# EAGLE board 3dofboard (EAGLE 6.5.0), part 1 of 2
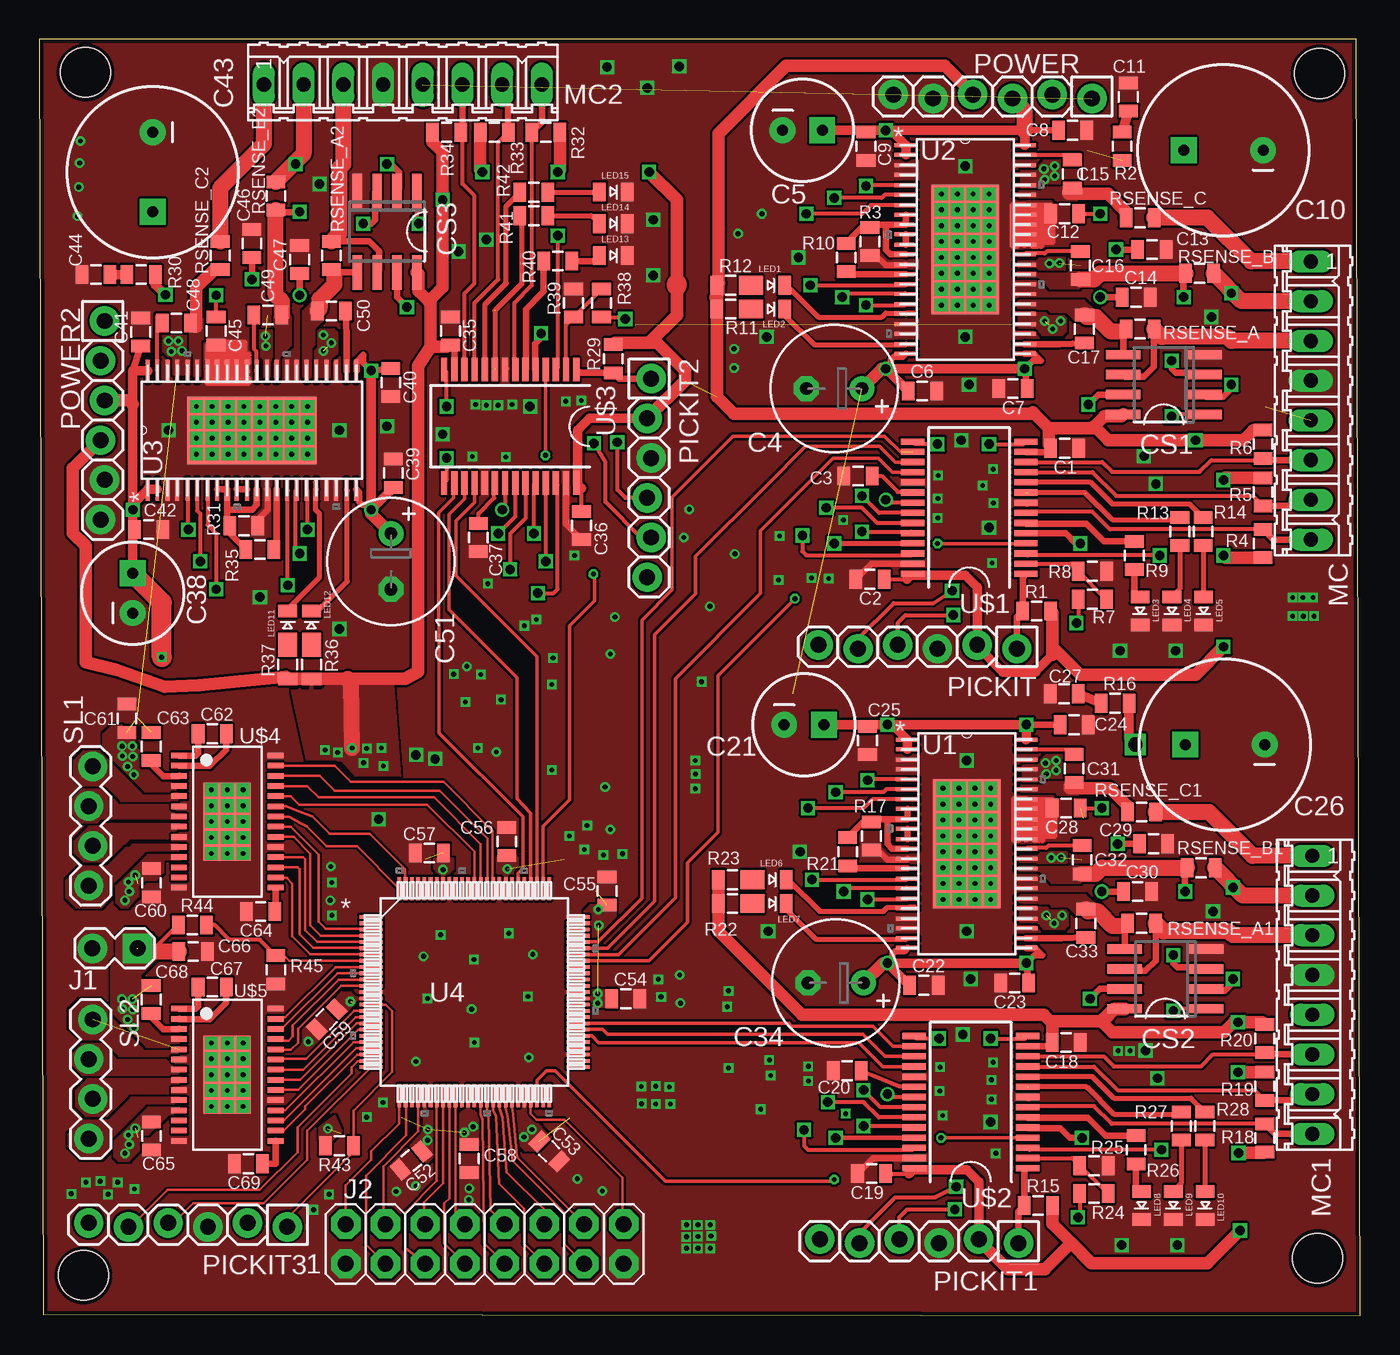
[diagram p3: board, top side]
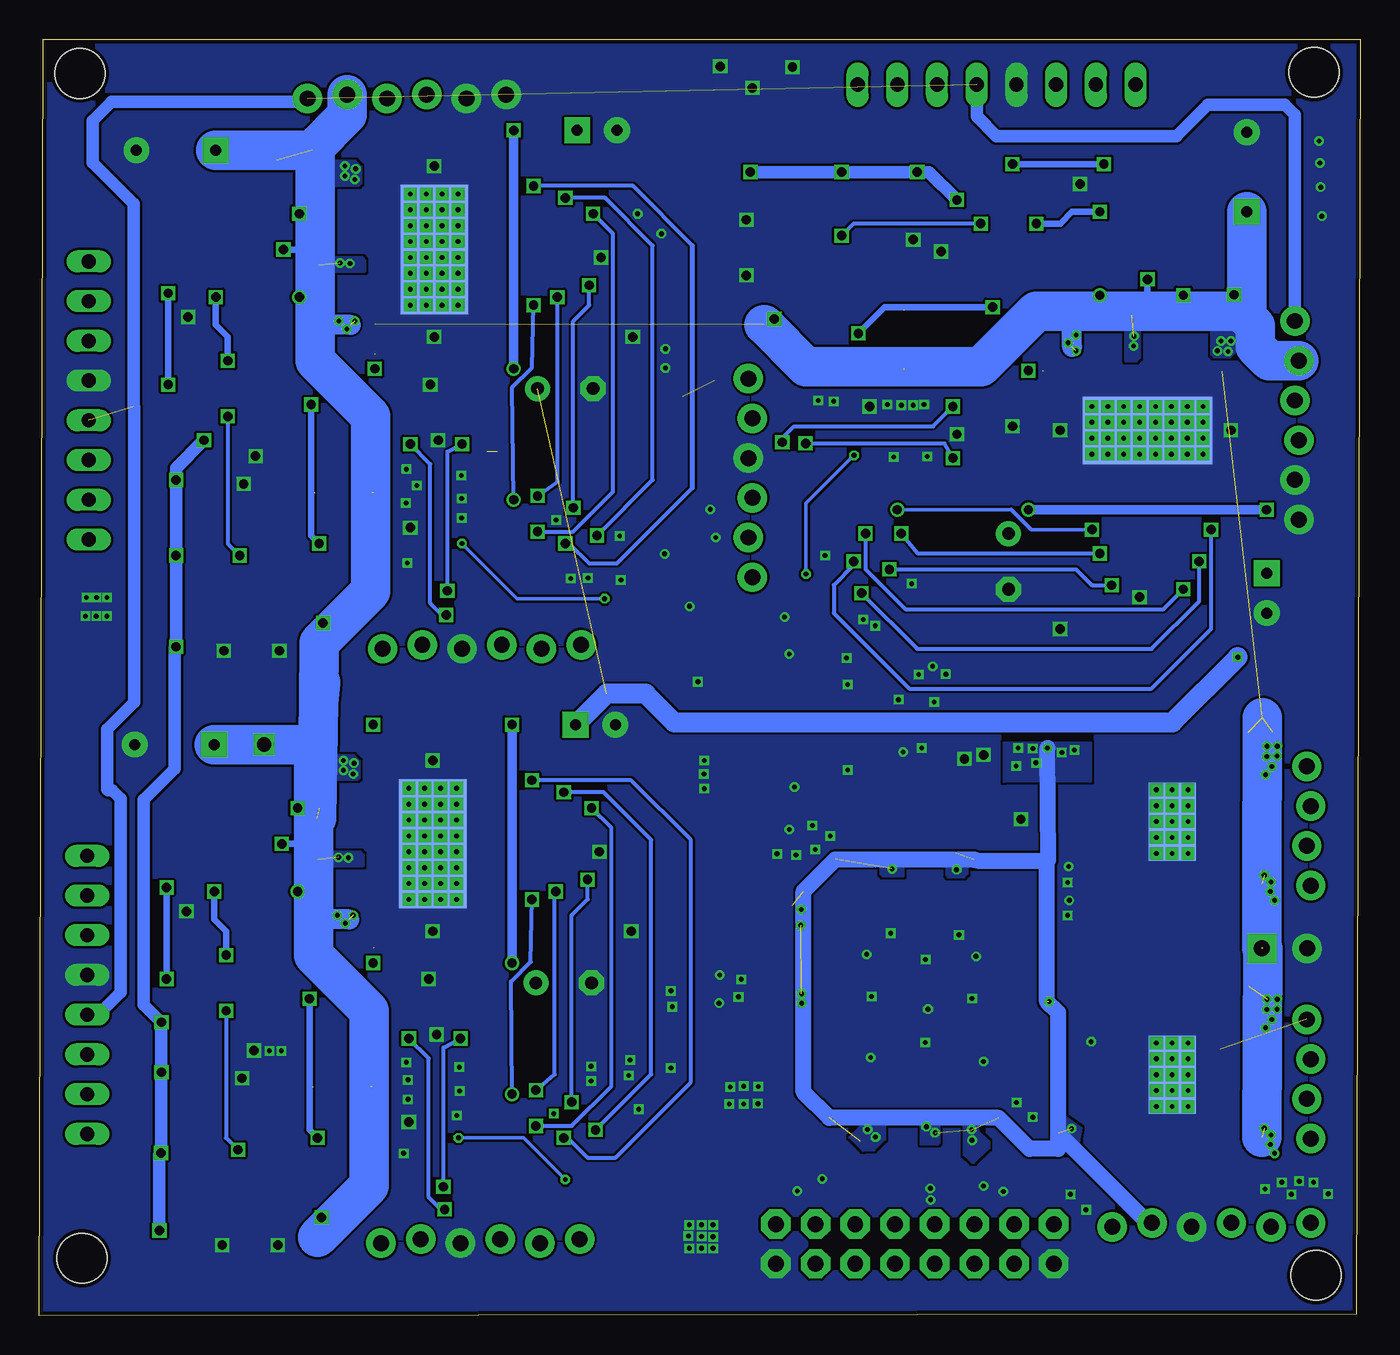
[diagram p4: board, bottom side, seen from below]

Size 84.51 x 81.63 mm. Coordinates in mm from the lower left corner, seen from the top.
Outline: 0.25,0.1 84.51,0 84.25,81.63 0,81.63 0.25,0.1
Copper layers (1*16): Top 0.035mm / dielectric 1.5mm / Bottom 0.035mm
Design rules "ITEADstudio_DRC": minimum track width 6mil, minimum drill 12mil, track to track 6mil, track to pad 6mil, pad to pad 6mil, via to via 6mil, smd to smd 0mil, copper to edge 10mil, drill to drill 10mil, minimum pad ring 10mil, minimum via ring 6mil, stop-mask expansion 2mil, vias tented up to drill 100mil, thermal gap 10mil
Holes 3.17 mm at 81.89,79.43 81.76,3.68 2.97,79.5 2.84,2.59

## Footprints (pad centres in the part's own frame; a part is rotated, then mirrored left to right if it is on the bottom)
0805 = smd 0.8 x 1.2: 1 -0.9,0; 2 0.9,0
E3,5-8 = drill 0.813 pad 1.6: + -1.778,0 | drill 0.813 pad 1.6 octagon: - 1.778,0
CPOL-RADIAL-100UF-25V = drill 0.7 pad 1.651 square: 1 1.27,0 | drill 0.7 pad 1.651: 2 -1.27,0
CPOL-RADIAL-1000UF-25V = drill 0.7 pad 1.651 square: 1 2.54,0 | drill 0.7 pad 1.651: 2 -2.54,0
SO8 = smd 0.6 x 2.2: 1 -1.905,-2.6; 2 -0.635,-2.6; 3 0.635,-2.6; 4 1.905,-2.6; 5 1.905,2.6; 6 0.635,2.6; 7 -0.635,2.6; 8 -1.905,2.6
1X02_LOCK = drill 1.016 pad 1.88 square: 1 -0.178,0 | drill 1.016 pad 1.88: 2 2.718,0
2X8 = drill 1.016 pad 1.88 octagon: 1 -8.89,-1.27; 2 -8.89,1.27; 3 -6.35,-1.27; 4 -6.35,1.27; 5 -3.81,-1.27; 6 -3.81,1.27; 7 -1.27,-1.27; 8 -1.27,1.27; 9 1.27,-1.27; 10 1.27,1.27; 11 3.81,-1.27; 12 3.81,1.27; 13 6.35,-1.27; 14 6.35,1.27; 15 8.89,-1.27; 16 8.89,1.27
LED-0805 = smd 0.8 x 1.2: 1 -0.9,0; 2 0.9,0
08P = drill 0.914 long: 1 -8.89,0; 2 -6.35,0; 3 -3.81,0; 4 -1.27,0; 5 1.27,0; 6 3.81,0; 7 6.35,0; 8 8.89,0
1X06_LOCK = drill 1.016 pad 1.88: 1 0,0.127; 2 2.54,-0.127; 3 5.08,0.127; 4 7.62,-0.127; 5 10.16,0.127; 6 12.7,-0.127
1X04_LOCK = drill 1.016 pad 1.88: 1 0,0.127; 2 2.54,-0.127; 3 5.08,0.127; 4 7.62,-0.127
DDW44_8P26X4P31 = smd 1.473 x 0.254: 1 -3.785,6.655; 2 -3.785,6.045; 3 -3.785,5.385; 4 -3.785,4.775; 5 -3.785,4.115; 6 -3.785,3.505; 7 -3.785,2.845; 8 -3.785,2.235; 9 -3.785,1.575; 10 -3.785,0.965; 11 -3.785,0.305; 12 -3.785,-0.305; 13 -3.785,-0.965; 14 -3.785,-1.575; 15 -3.785,-2.235; 16 -3.785,-2.845; 17 -3.785,-3.505; 18 -3.785,-4.115; 19 -3.785,-4.775; 20 -3.785,-5.385; 21 -3.785,-6.045; 22 -3.785,-6.655; 23 3.785,-6.655; 24 3.785,-6.045; 25 3.785,-5.385; 26 3.785,-4.775; 27 3.785,-4.115; 28 3.785,-3.505; 29 3.785,-2.845; 30 3.785,-2.235; 31 3.785,-1.575; 32 3.785,-0.965; 33 3.785,-0.305; 34 3.785,0.305; 35 3.785,0.965; 36 3.785,1.575; 37 3.785,2.235; 38 3.785,2.845; 39 3.785,3.505; 40 3.785,4.115; 41 3.785,4.775; 42 3.785,5.385; 43 3.785,6.045; 44 3.785,6.655 | smd 4.318 x 8.255: EPAD 0,0 | drill 0.305 square: P$1 -1.524,3.556; P$2 -0.508,3.556; P$3 0.508,3.556; P$4 1.524,3.556; P$5 -1.524,2.54; P$6 -0.508,2.54; P$7 0.508,2.54; P$8 1.524,2.54; P$9 -1.524,1.524; P$10 -0.508,1.524; P$11 0.508,1.524; P$12 1.524,1.524; P$13 -1.524,0.508; P$14 -0.508,0.508; P$15 0.508,0.508; P$16 1.524,0.508; P$17 -1.524,-0.508; P$18 -0.508,-0.508; P$19 0.508,-0.508; P$20 1.524,-0.508; P$21 -1.524,-1.524; P$22 -0.508,-1.524; P$23 0.508,-1.524; P$24 1.524,-1.524; P$25 -1.524,-2.54; P$26 -0.508,-2.54; P$27 0.508,-2.54; P$28 1.524,-2.54; P$29 -1.524,-3.556; P$30 -0.508,-3.556; P$31 0.508,-3.556; P$32 1.524,-3.556 | smd 4.318 x 8.255 bottom: P$33 0,0
TQFP100_12X12MC = smd 1.473 x 0.229: 1 -6.617,4.8; 2 -6.617,4.4; 3 -6.617,4; 4 -6.617,3.6; 5 -6.617,3.2; 6 -6.617,2.8; 7 -6.617,2.4; 8 -6.617,2; 9 -6.617,1.6; 10 -6.617,1.2; 11 -6.617,0.8; 12 -6.617,0.4; 13 -6.617,0; 14 -6.617,-0.4; 15 -6.617,-0.8; 16 -6.617,-1.2; 17 -6.617,-1.6; 18 -6.617,-2; 19 -6.617,-2.4; 20 -6.617,-2.8; 21 -6.617,-3.2; 22 -6.617,-3.6; 23 -6.617,-4; 24 -6.617,-4.4; 25 -6.617,-4.8; 51 6.617,-4.8; 52 6.617,-4.4; 53 6.617,-4; 54 6.617,-3.6; 55 6.617,-3.2; 56 6.617,-2.8; 57 6.617,-2.4; 58 6.617,-2; 59 6.617,-1.6; 60 6.617,-1.2; 61 6.617,-0.8; 62 6.617,-0.4; 63 6.617,0; 64 6.617,0.4; 65 6.617,0.8; 66 6.617,1.2; 67 6.617,1.6; 68 6.617,2; 69 6.617,2.4; 70 6.617,2.8; 71 6.617,3.2; 72 6.617,3.6; 73 6.617,4; 74 6.617,4.4; 75 6.617,4.8 | smd 0.229 x 1.473: 26 -4.8,-6.617; 27 -4.4,-6.617; 28 -4,-6.617; 29 -3.6,-6.617; 30 -3.2,-6.617; 31 -2.8,-6.617; 32 -2.4,-6.617; 33 -2,-6.617; 34 -1.6,-6.617; 35 -1.2,-6.617; 36 -0.8,-6.617; 37 -0.4,-6.617; 38 0,-6.617; 39 0.4,-6.617; 40 0.8,-6.617; 41 1.2,-6.617; 42 1.6,-6.617; 43 2,-6.617; 44 2.4,-6.617; 45 2.8,-6.617; 46 3.2,-6.617; 47 3.6,-6.617; 48 4,-6.617; 49 4.4,-6.617; 50 4.8,-6.617; 76 4.8,6.617; 77 4.4,6.617; 78 4,6.617; 79 3.6,6.617; 80 3.2,6.617; 81 2.8,6.617; 82 2.4,6.617; 83 2,6.617; 84 1.6,6.617; 85 1.2,6.617; 86 0.8,6.617; 87 0.4,6.617; 88 0,6.617; 89 -0.4,6.617; 90 -0.8,6.617; 91 -1.2,6.617; 92 -1.6,6.617; 93 -2,6.617; 94 -2.4,6.617; 95 -2.8,6.617; 96 -3.2,6.617; 97 -3.6,6.617; 98 -4,6.617; 99 -4.4,6.617; 100 -4.8,6.617
SSOP28 = smd 0.4 x 1.5: 1 -4.225,-3.625; 2 -3.575,-3.625; 3 -2.925,-3.625; 4 -2.275,-3.625; 5 -1.625,-3.625; 6 -0.975,-3.625; 7 -0.325,-3.625; 8 0.325,-3.625; 9 0.975,-3.625; 10 1.625,-3.625; 11 2.275,-3.625; 12 2.925,-3.625; 13 3.575,-3.625; 14 4.225,-3.625; 15 4.225,3.625; 16 3.575,3.625; 17 2.925,3.625; 18 2.275,3.625; 19 1.625,3.625; 20 0.975,3.625; 21 0.325,3.625; 22 -0.325,3.625; 23 -0.975,3.625; 24 -1.625,3.625; 25 -2.275,3.625; 26 -2.925,3.625; 27 -3.575,3.625; 28 -4.225,3.625
TSSOP-28 = smd 0.35 x 1: 1 -4.225,-3.087; 2 -3.575,-3.087; 3 -2.925,-3.087; 4 -2.275,-3.087; 5 -1.625,-3.087; 6 -0.975,-3.087; 7 -0.325,-3.087; 8 0.325,-3.087; 9 0.975,-3.087; 10 1.625,-3.087; 11 2.275,-3.087; 12 2.925,-3.087; 13 3.575,-3.087; 14 4.225,-3.087; 15 4.225,3.087; 16 3.575,3.087; 17 2.925,3.087; 18 2.275,3.087; 19 1.625,3.087; 20 0.975,3.087; 21 0.325,3.087; 22 -0.325,3.087; 23 -0.975,3.087; 24 -1.625,3.087; 25 -2.275,3.087; 26 -2.925,3.087; 27 -3.575,3.087; 28 -4.225,3.087 | smd 5 x 3: EXP 0,0 | drill 0.305 square: P$1 -2.032,1.016; P$2 -2.032,0; P$3 -2.032,-1.016; P$4 -1.016,1.016; P$5 -1.016,0; P$6 -1.016,-1.016; P$7 0,-1.016; P$9 0,1.016; P$10 1.016,1.016; P$11 1.016,0; P$12 1.016,-1.016; P$13 2.032,-1.016; P$14 2.032,0; P$15 2.032,1.016; P$16 0,0 | smd 5 x 3 bottom: P$8 0,0

## Placement (x,y rotation side)
C1  0.1u  [0805]  65.58,55.47 180 top
C2  0.1u  [0805]  53.14,47.09 180 top
C3  10u  [0805]  52.37,53.7 180 top
C4  330u  [E3,5-8]  50.85,59.28 180 top
C5  47u  [CPOL-RADIAL-100UF-25V]  48.82,75.79 0 top
C6  1u  [0805]  56.49,59.13 0 top
C7  1u  [0805]  62.28,59.28 180 top
C8  1u  [0805]  66.09,75.79 0 top
C9  1u  [0805]  52.88,74.78 270 top
C10  1000u  [CPOL-RADIAL-1000UF-25V]  75.74,74.52 180 top
C11  10n  [0805]  69.67,77.93 90 top
C12  0.1u  [0805]  65.58,70.46 180 top
C13  0.1u  [0805]  71.17,68.17 0 top
C14  0.1u  [0805]  70.15,65.13 0 top
C15  0.1u  [0805]  66.09,73 270 top
C16  0.1u  [0805]  66.6,67.16 270 top
C17  0.1u  [0805]  66.85,63.09 270 top
C18  0.1u  [0805]  65.68,17.48 180 top
C19  0.1u  [0805]  53.24,9.09 180 top
C20  10u  [0805]  51.69,15.67 180 top
C21  47u  [CPOL-RADIAL-100UF-25V]  48.92,37.8 0 top
C22  1u  [0805]  56.59,21.13 0 top
C23  1u  [0805]  62.38,21.29 180 top
C24  1u  [0805]  66.19,37.8 0 top
C25  1u  [0805]  52.98,36.78 270 top
C26  1000u  [CPOL-RADIAL-1000UF-25V]  75.84,36.53 180 top
C27  10n  [0805]  65.56,39.78 180 top
C28  0.1u  [0805]  65.68,32.46 180 top
C29  0.1u  [0805]  71.27,30.18 0 top
C30  0.1u  [0805]  70.26,27.13 0 top
C31  0.1u  [0805]  66.19,35 270 top
C32  0.1u  [0805]  66.7,29.16 270 top
C33  0.1u  [0805]  66.95,25.1 270 top
C34  330u  [E3,5-8]  50.95,21.29 180 top
C35  0.1u  [0805]  26.31,62.97 270 top
C36  0.1u  [0805]  34.7,50.52 270 top
C37  10u  [0805]  28.09,49.76 270 top
C38  47u  [CPOL-RADIAL-100UF-25V]  5.99,46.2 90 top
C39  1u  [0805]  22.66,53.87 90 top
C40  1u  [0805]  22.5,59.66 270 top
C41  1u  [0805]  6.5,62.89 90 top
C42  1u  [0805]  7.01,50.27 0 top
C43  1000u  [CPOL-RADIAL-1000UF-25V]  7.26,73.13 270 top
C44  10n  [0805]  3.63,66.57 180 top
C45  0.1u  [0805]  11.33,62.97 270 top
C46  0.1u  [0805]  13.61,68.55 90 top
C47  0.1u  [0805]  16.66,67.54 90 top
C48  0.1u  [0805]  8.79,63.47 0 top
C49  0.1u  [0805]  14.63,63.98 0 top
C50  0.1u  [0805]  18.69,64.24 0 top
C51  330u  [E3,5-8]  22.5,48.23 270 top
C52  0.1u  [0805]  23.8,9.94 220 top
C53  0.1u  [0805]  32.63,10.51 315 top
C54  0.1u  [0805]  37.52,20.27 0 top
C55  0.1u  [0805]  36.32,27.15 90 top
C56  0.1u  [0805]  29.92,30.33 90 top
C57  0.1u  [0805]  24.97,29.59 180 top
C58  0.1u  [0805]  27.51,10.06 270 top
C59  0.1u  [0805]  18.39,18.97 225 top
C60  10u  [0805]  7.19,27.69 270 top
C61  10u  [0805]  5.61,38.2 90 top
C62  .01u  [0805]  11.07,37.21 0 top
C63  .1u  [0805]  7.16,36.4 270 top
C64  0.47u  [0805]  14.17,25.86 180 top
C65  10u  [0805]  7.19,11.51 270 top
C66  10u  [0805]  9.86,23.29 0 top
C67  .01u  [0805]  11.07,21.03 0 top
C68  .1u  [0805]  7.16,20.22 270 top
C69  0.47u  [0805]  13.39,9.73 180 top
CS1  MAX4376  [SO8]  71.93,59.54 90 top
CS2  MAX4376  [SO8]  72.03,21.54 90 top
CS3  MAX4376  [SO8]  22.25,69.32 180 top
J1  [1X02_LOCK]  6.12,23.5 180 top
J2  M16DUAL_ROW  [2X8]  28.5,4.6 0 top
LED1  [LED-0805]  46.79,65.89 0 top
LED2  [LED-0805]  46.79,64.36 0 top
LED3  [LED-0805]  70.41,45.06 270 top
LED4  [LED-0805]  72.44,45.06 270 top
LED5  [LED-0805]  74.47,45.06 270 top
LED6  [LED-0805]  46.89,27.89 0 top
LED7  [LED-0805]  46.89,26.37 0 top
LED8  [LED-0805]  70.51,7.06 270 top
LED9  [LED-0805]  72.54,7.06 270 top
LED10  [LED-0805]  74.57,7.06 270 top
LED11  [LED-0805]  15.9,44.17 90 top
LED12  [LED-0805]  17.42,44.17 90 top
LED13  [LED-0805]  36.73,67.79 0 top
LED14  [LED-0805]  36.73,69.82 0 top
LED15  [LED-0805]  36.73,71.86 0 top
MC  [08P]  81.33,58.52 270 top
MC1  [08P]  81.43,20.52 270 top
MC2  [08P]  23.27,78.71 0 top
PICKIT  [1X06_LOCK]  62.53,42.77 180 top
PICKIT1  [1X06_LOCK]  62.64,4.78 180 top
PICKIT2  [1X06_LOCK]  39.01,59.92 270 top
PICKIT3  [1X06_LOCK]  15.88,5.82 180 top
POWER  [1X06_LOCK]  67.34,77.95 180 top
POWER2  [1X06_LOCK]  4.06,63.6 270 top
R1  10k  [0805]  63.8,45.06 0 top
R2  3.3  [0805]  69.27,74.78 270 top
R3  1  [0805]  53.14,68.68 90 top
R4  10k  [0805]  78.28,49.38 90 top
R5  10k  [0805]  78.28,52.68 270 top
R6  10k  [0805]  78.28,55.73 270 top
R7  75k  [0805]  67.36,45.82 0 top
R8  25k  [0805]  67.36,47.6 0 top
R9  330  [0805]  70.05,48.62 270 top
R10  200k  [0805]  51.61,67.67 90 top
R11  330  [0805]  44.25,64.36 0 top
R12  330  [0805]  44.25,65.89 0 top
R13  330  [0805]  72.95,50.14 270 top
R14  330  [0805]  74.45,50.14 270 top
R15  10k  [0805]  63.91,7.06 0 top
R16  3.3  [0805]  68.81,39.17 0 top
R17  1  [0805]  53.24,30.68 90 top
R18  10k  [0805]  78.38,11.38 90 top
R19  10k  [0805]  78.38,14.68 270 top
R20  10k  [0805]  78.38,17.73 270 top
R21  200k  [0805]  51.71,29.67 90 top
R22  330  [0805]  44.35,26.37 0 top
R23  330  [0805]  44.35,27.89 0 top
R24  75k  [0805]  67.46,7.82 0 top
R25  25k  [0805]  67.46,9.6 0 top
R26  330  [0805]  70.15,10.62 270 top
R27  330  [0805]  73.05,12.14 270 top
R28  330  [0805]  74.55,12.14 270 top
R29  10k  [0805]  36.73,61.19 90 top
R30  3.3  [0805]  6.53,66.57 0 top
R31  1  [0805]  13.11,50.52 180 top
R32  10k  [0805]  32.41,75.67 180 top
R33  10k  [0805]  29.11,75.67 0 top
R34  10k  [0805]  26.06,75.67 0 top
R35  200k  [0805]  14.12,49 180 top
R36  330  [0805]  17.42,41.63 90 top
R37  330  [0805]  15.9,41.63 90 top
R38  75k  [0805]  35.97,64.74 90 top
R39  25k  [0805]  34.19,64.74 90 top
R40  330  [0805]  33.17,67.44 0 top
R41  330  [0805]  31.65,70.33 0 top
R42  330  [0805]  31.65,71.83 0 top
R43  10k  [0805]  19.2,10.87 180 top
R44  75k  [0805]  9.8,24.99 0 top
R45  25k  [0805]  15.14,22.12 270 top
RSENSE_A  0.1  [0805]  70.41,63.09 180 top
RSENSE_A1  0.1  [0805]  70.51,25.1 180 top
RSENSE_A2  0.1  [0805]  18.69,67.79 270 top
RSENSE_B  0.1  [0805]  74.22,66.65 180 top
RSENSE_B1  0.1  [0805]  74.32,28.65 180 top
RSENSE_B2  0.1  [0805]  15.14,71.6 270 top
RSENSE_C  0.1  [0805]  70.41,70.21 180 top
RSENSE_C1  0.1  [0805]  70.51,32.21 180 top
RSENSE_C2  0.1  [0805]  11.58,67.79 270 top
SL1  [1X04_LOCK]  3.3,35.13 270 top
SL2  [1X04_LOCK]  3.3,18.95 270 top
U1  DRV8312_DDW_44  [DDW44_8P26X4P31]  59.33,30.18 0 top
U2  DRV8312_DDW_44  [DDW44_8P26X4P31]  59.23,68.17 0 top
U3  DRV8312_DDW_44  [DDW44_8P26X4P31]  13.61,56.62 90 top
U4  PIC32MZXXXXEC(G/H/M)100-I/PT  [TQFP100_12X12MC]  27.84,20.7 0 top
U$1  [SSOP28]  59.49,51.66 90 top
U$2  [SSOP28]  59.59,13.67 90 top
U$3  [SSOP28]  30.12,56.87 180 top
U$4  DRV8844PWP  [TSSOP-28]  12.04,31.6 270 top
U$5  DRV8844PWP  [TSSOP-28]  12.04,15.42 270 top